# Altium schematic sheet K22F_Shield.SchDoc
size A4; DocumentNumber: 2; SheetNumber: 2
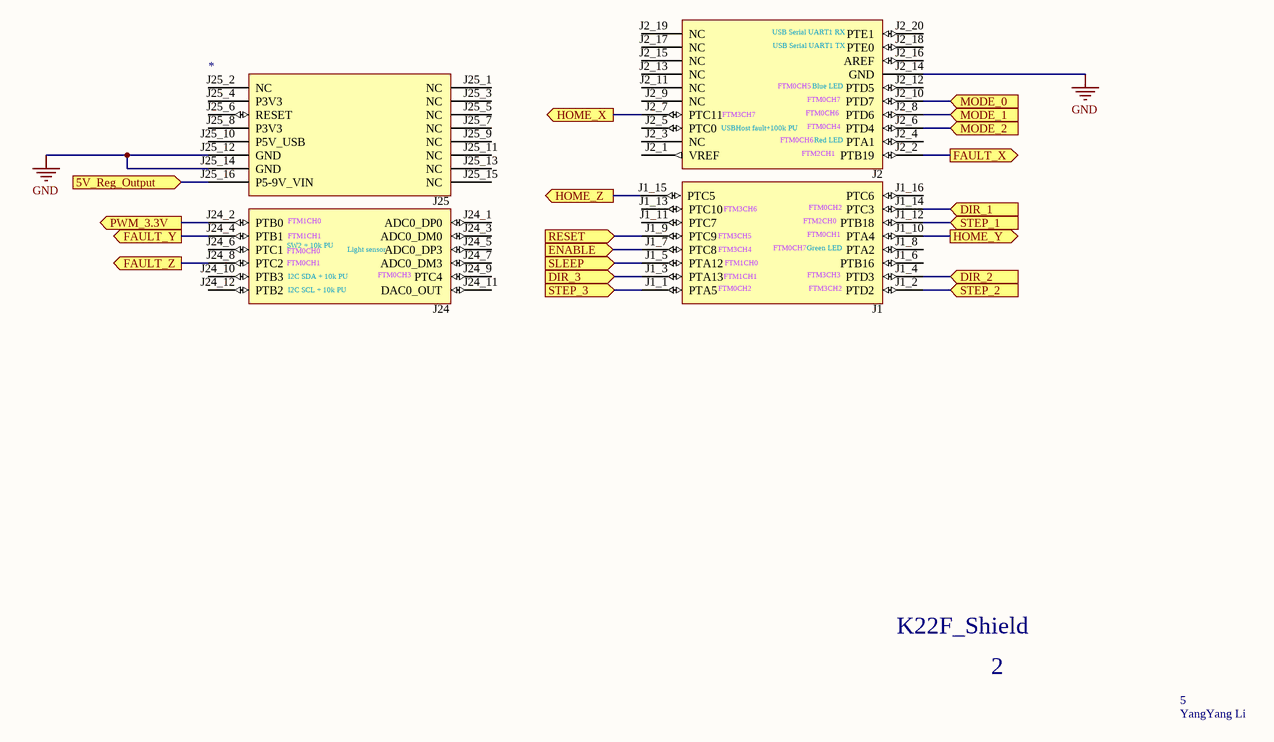
[diagram p0: K22F_Shield.SchDoc]

## Parts
*1  *  [FRDM-K22F]

## Ports
5V_Reg_Output (in), DIR_1 (in), DIR_2 (in), DIR_3 (in), ENABLE (in), FAULT_X (out), FAULT_Y (out), FAULT_Z (out), HOME_X (out), HOME_Y (out), HOME_Z (out), MODE_0 (in), MODE_1 (in), MODE_2 (in), PWM_3.3V (out), RESET (in), SLEEP (in), STEP_1 (in), STEP_2 (in), STEP_3 (in)

## Nets
GND: *1.J2_14(GND) *1.J25_12(GND) *1.J25_14(GND)
5V_Reg_Output: *1.J25_16(P5-9V_VIN) ; port 5V_Reg_Output
DIR_1: *1.J1_14(PTC3) ; port DIR_1
DIR_2: *1.J1_4(PTD3) ; port DIR_2
DIR_3: *1.J1_3(PTA13) ; port DIR_3
ENABLE: *1.J1_7(PTC8) ; port ENABLE
FAULT_X: *1.J2_2(PTB19) ; port FAULT_X
FAULT_Y: *1.J24_4(PTB1) ; port FAULT_Y
FAULT_Z: *1.J24_8(PTC2) ; port FAULT_Z
HOME_X: *1.J2_7(PTC11) ; port HOME_X
HOME_Y: *1.J1_10(PTA4) ; port HOME_Y
HOME_Z: *1.J1_15(PTC5) ; port HOME_Z
MODE_0: *1.J2_10(PTD7) ; port MODE_0
MODE_1: *1.J2_8(PTD6) ; port MODE_1
MODE_2: *1.J2_6(PTD4) ; port MODE_2
PWM_3.3V: *1.J24_2(PTB0) ; port PWM_3.3V
RESET: *1.J1_9(PTC9) ; port RESET
SLEEP: *1.J1_5(PTA12) ; port SLEEP
STEP_1: *1.J1_12(PTB18) ; port STEP_1
STEP_2: *1.J1_2(PTD2) ; port STEP_2
STEP_3: *1.J1_1(PTA5) ; port STEP_3

Not connected (* = marked no-connect by the designer): *1 J1_6(PTB16) J1_8(PTA2) J1_11(PTC7) J1_13(PTC10) J1_16(PTC6) J2_1(VREF) J2_3(NC) J2_4(PTA1) J2_5(PTC0) J2_9(NC) J2_11(NC) J2_12(PTD5) J2_13(NC) J2_15(NC) J2_16(AREF) J2_17(NC) J2_18(PTE0) J2_19(NC) J2_20(PTE1) J24_1(ADC0_DP0) J24_3(ADC0_DM0) J24_5(ADC0_DP3) J24_6(PTC1) J24_7(ADC0_DM3) J24_9(PTC4) J24_10(PTB3) J24_11(DAC0_OUT) J24_12(PTB2) J25_1(NC) J25_2(NC) J25_3(NC) J25_4(P3V3) J25_5(NC) J25_6(RESET) J25_7(NC) J25_8(P3V3) J25_9(NC) J25_10(P5V_USB) J25_11(NC) J25_13(NC) J25_15(NC)

## Notes on the sheet
- K22F_Shield
- 2
- 5
- YangYang Li
- (in symbol NXP FRDM-K22F) USB Serial UART1 RX; USB Serial UART1 TX; FTM0CH5; Blue LED; FTM0CH7; FTM3CH7; FTM0CH6; USBHost fault+100k PU; FTM0CH4; Red LED; FTM2CH1; J2; J25; FTM3CH6; FTM0CH2; FTM1CH0; FTM2CH0; FTM1CH1; FTM3CH5; FTM0CH1; SW2 + 10k PU; FTM0CH0; Light sensor; FTM3CH4; Green LED; I2C SDA + 10k PU; FTM0CH3; FTM3CH3; I2C SCL + 10k PU; FTM3CH2; J24; J1

## Library data of the parts
*1 = NXP FRDM-K22F